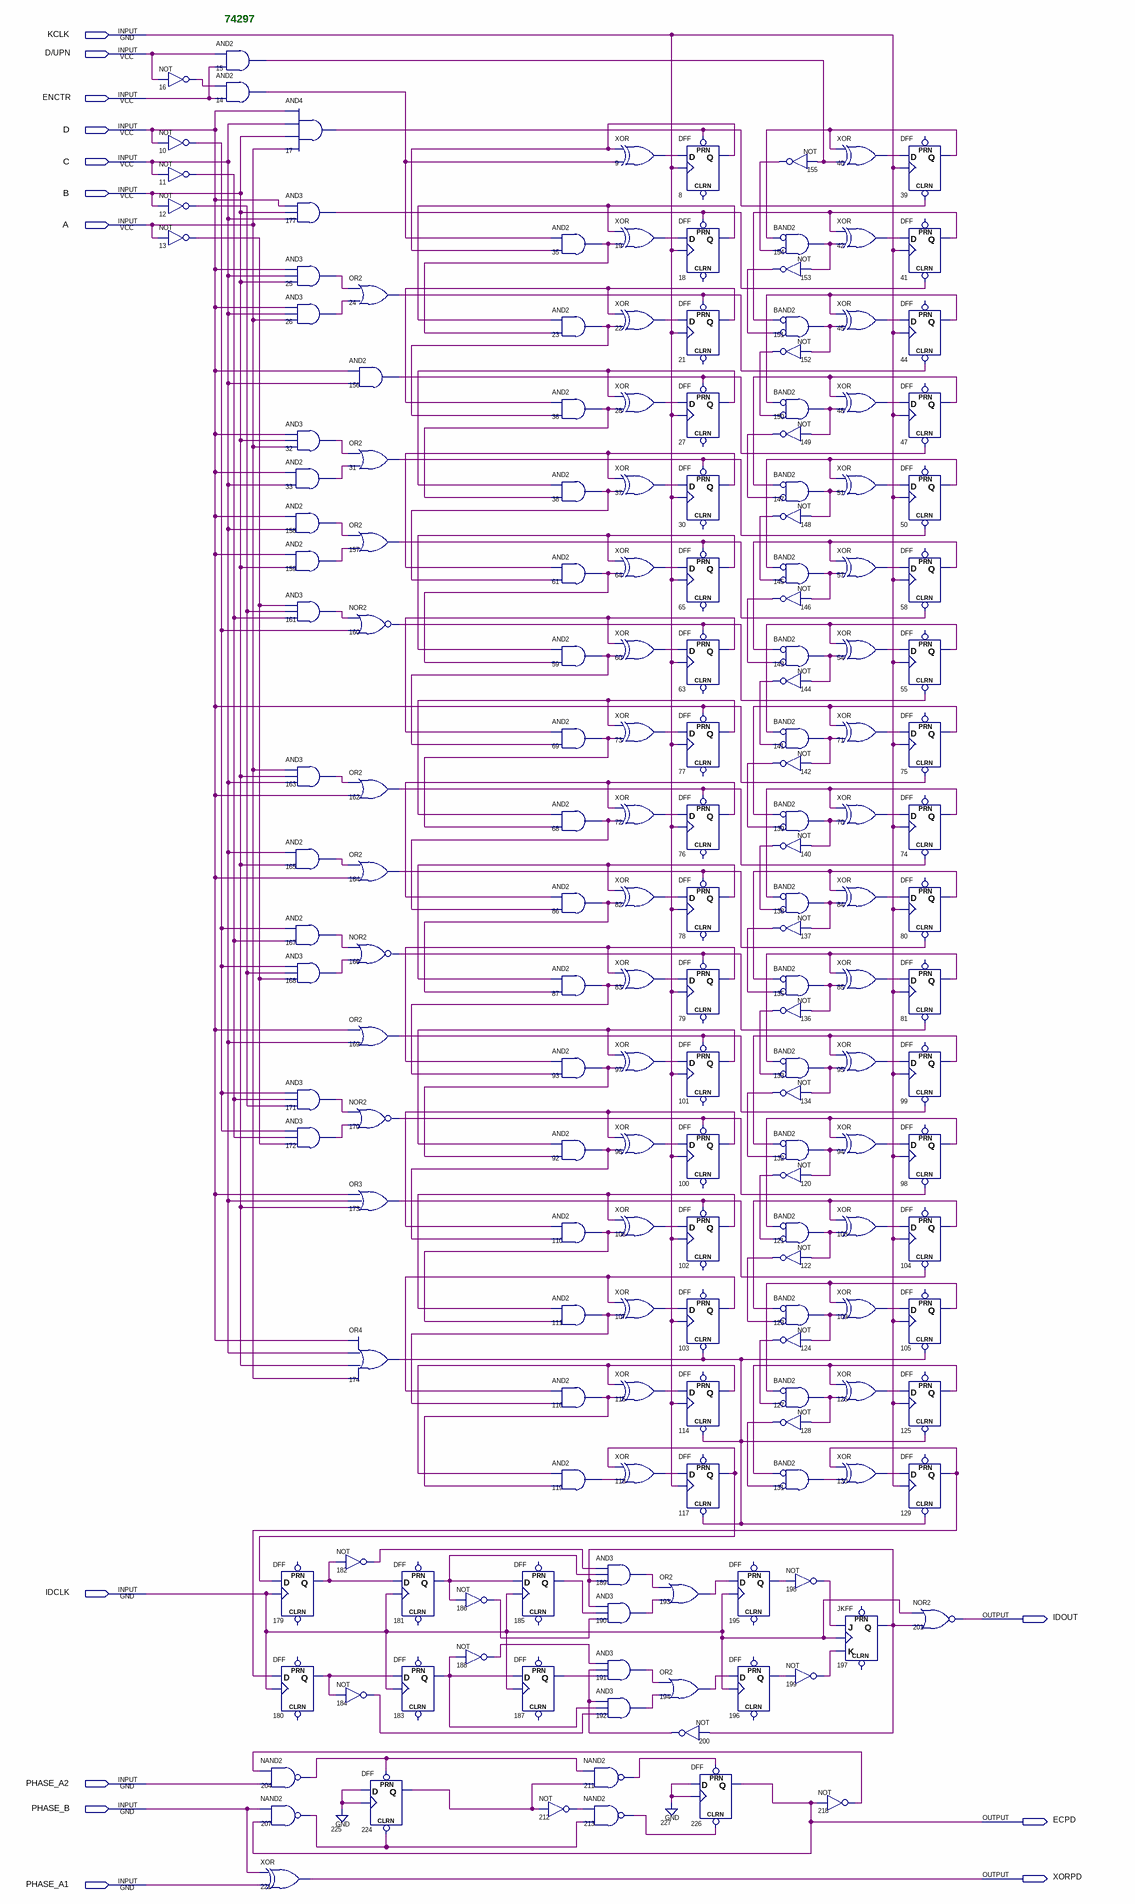
[diagram p0: schematic sheet]
// Quartus schematic 74297.bdf as structural Verilog: 182 symbols, 14 pins
module \74297  (
  input  KCLK,
  input  \D/UPN ,
  input  ENCTR,
  input  D,
  input  C,
  input  B,
  input  A,
  input  IDCLK,
  input  PHASE_A2,
  input  PHASE_B,
  input  PHASE_A1,
  output IDOUT,
  output ECPD,
  output XORPD
);

  wire n8_q, n9_out, n10_out, n11_out, n12_out, n13_out, n14_out, n15_out, n16_out, n17_out, n18_q, n19_out,
       n21_q, n22_out, n23_out, n24_out, n25_out, n26_out, n27_q, n28_out, n30_q, n31_out, n32_out, n33_out,
       n35_out, n36_out, n37_out, n38_out, n39_q, n40_out, n41_q, n42_out, n44_q, n45_out, n47_q, n48_out,
       n50_q, n51_out, n54_out, n55_q, n57_out, n58_q, n59_out, n60_out, n61_out, n63_q, n64_out, n65_q,
       n68_out, n69_out, n70_out, n71_out, n72_out, n73_out, n74_q, n75_q, n76_q, n77_q, n78_q, n79_q, n80_q,
       n81_q, n82_out, n83_out, n84_out, n85_out, n86_out, n87_out, n92_out, n93_out, n94_out, n95_out,
       n96_out, n97_out, n98_q, n99_q, n100_q, n101_q, n102_q, n103_q, n104_q, n105_q, n106_out, n107_out,
       n108_out, n109_out, n110_out, n111_out, n114_q, n115_out, n116_out, n117_q, n118_out, n119_out,
       n120_out, n121_out, n122_out, n123_out, n124_out, n125_q, n126_out, n127_out, n128_out, n129_q,
       n130_out, n131_out, n132_out, n133_out, n134_out, n135_out, n136_out, n137_out, n138_out, n139_out,
       n140_out, n141_out, n142_out, n143_out, n144_out, n145_out, n146_out, n147_out, n148_out, n149_out,
       n150_out, n151_out, n152_out, n153_out, n154_out, n155_out, n156_out, n157_out, n158_out, n159_out,
       n160_out, n161_out, n162_out, n163_out, n164_out, n165_out, n166_out, n167_out, n168_out, n169_out,
       n170_out, n171_out, n172_out, n173_out, n174_out, n177_out, n179_q, n180_q, n181_q, n182_out, n183_q,
       n184_out, n185_q, n186_out, n187_q, n188_out, n189_out, n190_out, n191_out, n192_out, n193_out,
       n194_out, n195_q, n196_q, n197_q, n198_out, n199_out, n200_out, n204_out, n207_out, n211_out,
       n212_out, n213_out, n218_out, n224_q;

  not u_16 (n16_out, \D/UPN );
  not u_10 (n10_out, D);
  not u_11 (n11_out, C);
  not u_12 (n12_out, B);
  not u_13 (n13_out, A);
  and u_15 (n15_out, \D/UPN , ENCTR);
  and u_14 (n14_out, n16_out, ENCTR);
  and u_17 (n17_out, D, C, B, A);
  and u_177 (n177_out, D, B, C);
  and u_25 (n25_out, D, C, B);
  and u_26 (n26_out, D, C, A);
  and u_32 (n32_out, D, B, A);
  and u_33 (n33_out, D, C);
  and u_158 (n158_out, D, C);
  and u_159 (n159_out, D, B);
  and u_161 (n161_out, n13_out, n12_out, n11_out);
  and u_163 (n163_out, A, B, C);
  and u_165 (n165_out, C, B);
  and u_167 (n167_out, n10_out, n11_out);
  and u_168 (n168_out, n10_out, n12_out, n13_out);
  and u_171 (n171_out, n10_out, n11_out, n12_out);
  and u_172 (n172_out, n10_out, n11_out, n13_out);
  DFF u_179 (.CLK(IDCLK), .D(n117_q), .Q(n179_q));  // open: CLRN, PRN
  DFF u_180 (.CLK(IDCLK), .D(n129_q), .Q(n180_q));  // open: CLRN, PRN
  nand u_204 (n204_out, n218_out, PHASE_A2);
  nand u_207 (n207_out, PHASE_B, ECPD);
  xor u_221 (XORPD, PHASE_B, PHASE_A1);
  not u_182 (n182_out, n179_q);
  not u_184 (n184_out, n180_q);
  or u_24 (n24_out, n25_out, n26_out);
  and u_156 (n156_out, D, C);
  or u_31 (n31_out, n32_out, n33_out);
  or u_157 (n157_out, n158_out, n159_out);
  nor u_160 (n160_out, n161_out, n10_out);
  or u_162 (n162_out, n163_out, D);
  or u_164 (n164_out, n165_out, D);
  nor u_166 (n166_out, n167_out, n168_out);
  or u_169 (n169_out, D, C);
  nor u_170 (n170_out, n171_out, n172_out);
  or u_173 (n173_out, D, C, B);
  or u_174 (n174_out, D, C, B, A);
  DFF u_181 (.CLK(IDCLK), .D(n179_q), .Q(n181_q));  // open: CLRN, PRN
  DFF u_183 (.CLK(IDCLK), .D(n180_q), .Q(n183_q));  // open: CLRN, PRN
  DFF u_224 (.CLRN(n207_out), .CLK(1'b0), .D(1'b0), .PRN(n204_out), .Q(n224_q));
  not u_186 (n186_out, n181_q);
  not u_188 (n188_out, n183_q);
  DFF u_185 (.CLK(IDCLK), .D(n181_q), .Q(n185_q));  // open: CLRN, PRN
  DFF u_187 (.CLK(IDCLK), .D(n183_q), .Q(n187_q));  // open: CLRN, PRN
  not u_212 (n212_out, n224_q);
  and u_35 (n35_out, n14_out, n8_q);
  and u_23 (n23_out, n18_q, n35_out);
  and u_36 (n36_out, n21_q, n23_out);
  and u_38 (n38_out, n27_q, n36_out);
  and u_61 (n61_out, n30_q, n38_out);
  and u_59 (n59_out, n65_q, n61_out);
  and u_69 (n69_out, n63_q, n59_out);
  and u_68 (n68_out, n77_q, n69_out);
  and u_86 (n86_out, n76_q, n68_out);
  and u_87 (n87_out, n78_q, n86_out);
  and u_93 (n93_out, n79_q, n87_out);
  and u_92 (n92_out, n101_q, n93_out);
  and u_110 (n110_out, n100_q, n92_out);
  and u_111 (n111_out, n102_q, n110_out);
  and u_116 (n116_out, n103_q, n111_out);
  and u_119 (n119_out, n114_q, n116_out);
  and u_189 (n189_out, n182_out, n181_q, n197_q);
  and u_190 (n190_out, n197_q, n185_q, n186_out);
  and u_191 (n191_out, n188_out, n200_out, n187_q);
  and u_192 (n192_out, n200_out, n183_q, n184_out);
  nand u_211 (n211_out, n204_out, n224_q);
  nand u_213 (n213_out, n212_out, n207_out);
  xor u_9 (n9_out, n8_q, n14_out);
  xor u_19 (n19_out, n18_q, n35_out);
  xor u_22 (n22_out, n21_q, n23_out);
  xor u_28 (n28_out, n27_q, n36_out);
  xor u_37 (n37_out, n30_q, n38_out);
  xor u_64 (n64_out, n65_q, n61_out);
  xor u_60 (n60_out, n63_q, n59_out);
  xor u_73 (n73_out, n77_q, n69_out);
  xor u_72 (n72_out, n76_q, n68_out);
  xor u_82 (n82_out, n78_q, n86_out);
  xor u_83 (n83_out, n79_q, n87_out);
  xor u_97 (n97_out, n101_q, n93_out);
  xor u_96 (n96_out, n100_q, n92_out);
  xor u_106 (n106_out, n102_q, n110_out);
  xor u_107 (n107_out, n103_q, n111_out);
  xor u_115 (n115_out, n114_q, n116_out);
  xor u_118 (n118_out, n117_q, n119_out);
  DFF u_8 (.CLK(KCLK), .D(n9_out), .PRN(n17_out), .Q(n8_q));  // open: CLRN
  DFF u_18 (.CLK(KCLK), .D(n19_out), .PRN(n177_out), .Q(n18_q));  // open: CLRN
  DFF u_21 (.CLK(KCLK), .D(n22_out), .PRN(n24_out), .Q(n21_q));  // open: CLRN
  DFF u_27 (.CLK(KCLK), .D(n28_out), .PRN(n156_out), .Q(n27_q));  // open: CLRN
  DFF u_30 (.CLK(KCLK), .D(n37_out), .PRN(n31_out), .Q(n30_q));  // open: CLRN
  DFF u_65 (.CLK(KCLK), .D(n64_out), .PRN(n157_out), .Q(n65_q));  // open: CLRN
  DFF u_63 (.CLK(KCLK), .D(n60_out), .PRN(n160_out), .Q(n63_q));  // open: CLRN
  DFF u_77 (.CLK(KCLK), .D(n73_out), .PRN(D), .Q(n77_q));  // open: CLRN
  DFF u_76 (.CLK(KCLK), .D(n72_out), .PRN(n162_out), .Q(n76_q));  // open: CLRN
  DFF u_78 (.CLK(KCLK), .D(n82_out), .PRN(n164_out), .Q(n78_q));  // open: CLRN
  DFF u_79 (.CLK(KCLK), .D(n83_out), .PRN(n166_out), .Q(n79_q));  // open: CLRN
  DFF u_101 (.CLK(KCLK), .D(n97_out), .PRN(n169_out), .Q(n101_q));  // open: CLRN
  DFF u_100 (.CLK(KCLK), .D(n96_out), .PRN(n170_out), .Q(n100_q));  // open: CLRN
  DFF u_102 (.CLK(KCLK), .D(n106_out), .PRN(n173_out), .Q(n102_q));  // open: CLRN
  DFF u_103 (.CLRN(n174_out), .CLK(KCLK), .D(n107_out), .Q(n103_q));  // open: PRN
  DFF u_114 (.CLRN(n174_out), .CLK(KCLK), .D(n115_out), .Q(n114_q));  // open: PRN
  DFF u_117 (.CLRN(n174_out), .CLK(KCLK), .D(n118_out), .Q(n117_q));  // open: PRN
  or u_193 (n193_out, n189_out, n190_out);
  or u_194 (n194_out, n191_out, n192_out);
  not u_200 (n200_out, n197_q);
  DFF u_226 (.CLRN(n213_out), .CLK(1'b0), .D(1'b0), .PRN(n211_out), .Q(ECPD));
  DFF u_195 (.CLK(IDCLK), .D(n193_out), .Q(n195_q));  // open: CLRN, PRN
  DFF u_196 (.CLK(IDCLK), .D(n194_out), .Q(n196_q));  // open: CLRN, PRN
  not u_155 (n155_out, n15_out);
  and u_154 (n154_out, ~n39_q, ~n155_out);  // BAND2
  not u_153 (n153_out, n154_out);
  and u_151 (n151_out, ~n41_q, ~n153_out);  // BAND2
  not u_152 (n152_out, n151_out);
  and u_150 (n150_out, ~n44_q, ~n152_out);  // BAND2
  not u_149 (n149_out, n150_out);
  and u_147 (n147_out, ~n47_q, ~n149_out);  // BAND2
  not u_148 (n148_out, n147_out);
  and u_145 (n145_out, ~n50_q, ~n148_out);  // BAND2
  not u_146 (n146_out, n145_out);
  and u_143 (n143_out, ~n58_q, ~n146_out);  // BAND2
  not u_144 (n144_out, n143_out);
  and u_141 (n141_out, ~n55_q, ~n144_out);  // BAND2
  not u_142 (n142_out, n141_out);
  and u_139 (n139_out, ~n75_q, ~n142_out);  // BAND2
  not u_140 (n140_out, n139_out);
  and u_138 (n138_out, ~n74_q, ~n140_out);  // BAND2
  not u_137 (n137_out, n138_out);
  and u_135 (n135_out, ~n80_q, ~n137_out);  // BAND2
  not u_136 (n136_out, n135_out);
  and u_133 (n133_out, ~n81_q, ~n136_out);  // BAND2
  not u_134 (n134_out, n133_out);
  and u_132 (n132_out, ~n99_q, ~n134_out);  // BAND2
  not u_120 (n120_out, n132_out);
  and u_121 (n121_out, ~n98_q, ~n120_out);  // BAND2
  not u_122 (n122_out, n121_out);
  and u_123 (n123_out, ~n104_q, ~n122_out);  // BAND2
  not u_124 (n124_out, n123_out);
  and u_127 (n127_out, ~n105_q, ~n124_out);  // BAND2
  not u_128 (n128_out, n127_out);
  and u_131 (n131_out, ~n125_q, ~n128_out);  // BAND2
  not u_198 (n198_out, n195_q);
  not u_199 (n199_out, n196_q);
  xor u_40 (n40_out, n39_q, n15_out);
  xor u_42 (n42_out, n41_q, n154_out);
  xor u_45 (n45_out, n44_q, n151_out);
  xor u_48 (n48_out, n47_q, n150_out);
  xor u_51 (n51_out, n50_q, n147_out);
  xor u_57 (n57_out, n58_q, n145_out);
  xor u_54 (n54_out, n55_q, n143_out);
  xor u_71 (n71_out, n75_q, n141_out);
  xor u_70 (n70_out, n74_q, n139_out);
  xor u_84 (n84_out, n80_q, n138_out);
  xor u_85 (n85_out, n81_q, n135_out);
  xor u_95 (n95_out, n99_q, n133_out);
  xor u_94 (n94_out, n98_q, n132_out);
  xor u_108 (n108_out, n104_q, n121_out);
  xor u_109 (n109_out, n105_q, n123_out);
  xor u_126 (n126_out, n125_q, n127_out);
  xor u_130 (n130_out, n129_q, n131_out);
  JKFF u_197 (.K(n199_out), .J(n198_out), .CLK(IDCLK), .Q(n197_q));  // open: PRN, CLRN
  not u_218 (n218_out, ECPD);
  DFF u_39 (.CLRN(n17_out), .CLK(KCLK), .D(n40_out), .Q(n39_q));  // open: PRN
  DFF u_41 (.CLRN(n177_out), .CLK(KCLK), .D(n42_out), .Q(n41_q));  // open: PRN
  DFF u_44 (.CLRN(n24_out), .CLK(KCLK), .D(n45_out), .Q(n44_q));  // open: PRN
  DFF u_47 (.CLRN(n156_out), .CLK(KCLK), .D(n48_out), .Q(n47_q));  // open: PRN
  DFF u_50 (.CLRN(n31_out), .CLK(KCLK), .D(n51_out), .Q(n50_q));  // open: PRN
  DFF u_58 (.CLRN(n157_out), .CLK(KCLK), .D(n57_out), .Q(n58_q));  // open: PRN
  DFF u_55 (.CLRN(n160_out), .CLK(KCLK), .D(n54_out), .Q(n55_q));  // open: PRN
  DFF u_75 (.CLRN(D), .CLK(KCLK), .D(n71_out), .Q(n75_q));  // open: PRN
  DFF u_74 (.CLRN(n162_out), .CLK(KCLK), .D(n70_out), .Q(n74_q));  // open: PRN
  DFF u_80 (.CLRN(n164_out), .CLK(KCLK), .D(n84_out), .Q(n80_q));  // open: PRN
  DFF u_81 (.CLRN(n166_out), .CLK(KCLK), .D(n85_out), .Q(n81_q));  // open: PRN
  DFF u_99 (.CLRN(n169_out), .CLK(KCLK), .D(n95_out), .Q(n99_q));  // open: PRN
  DFF u_98 (.CLRN(n170_out), .CLK(KCLK), .D(n94_out), .Q(n98_q));  // open: PRN
  DFF u_104 (.CLRN(n173_out), .CLK(KCLK), .D(n108_out), .Q(n104_q));  // open: PRN
  DFF u_105 (.CLRN(n174_out), .CLK(KCLK), .D(n109_out), .Q(n105_q));  // open: PRN
  DFF u_125 (.CLRN(n174_out), .CLK(KCLK), .D(n126_out), .Q(n125_q));  // open: PRN
  DFF u_129 (.CLRN(n174_out), .CLK(KCLK), .D(n130_out), .Q(n129_q));  // open: PRN
  nor u_201 (IDOUT, IDCLK, n197_q);

  // Notes on the sheet:
  //   74297
endmodule
